# EAGLE design NoMD (EAGLE 9.6.2)
CNAME: Battle Bots Board; CREVISION: R1; DESIGNER: Alexander Blackman

## Sheet 1 of 2
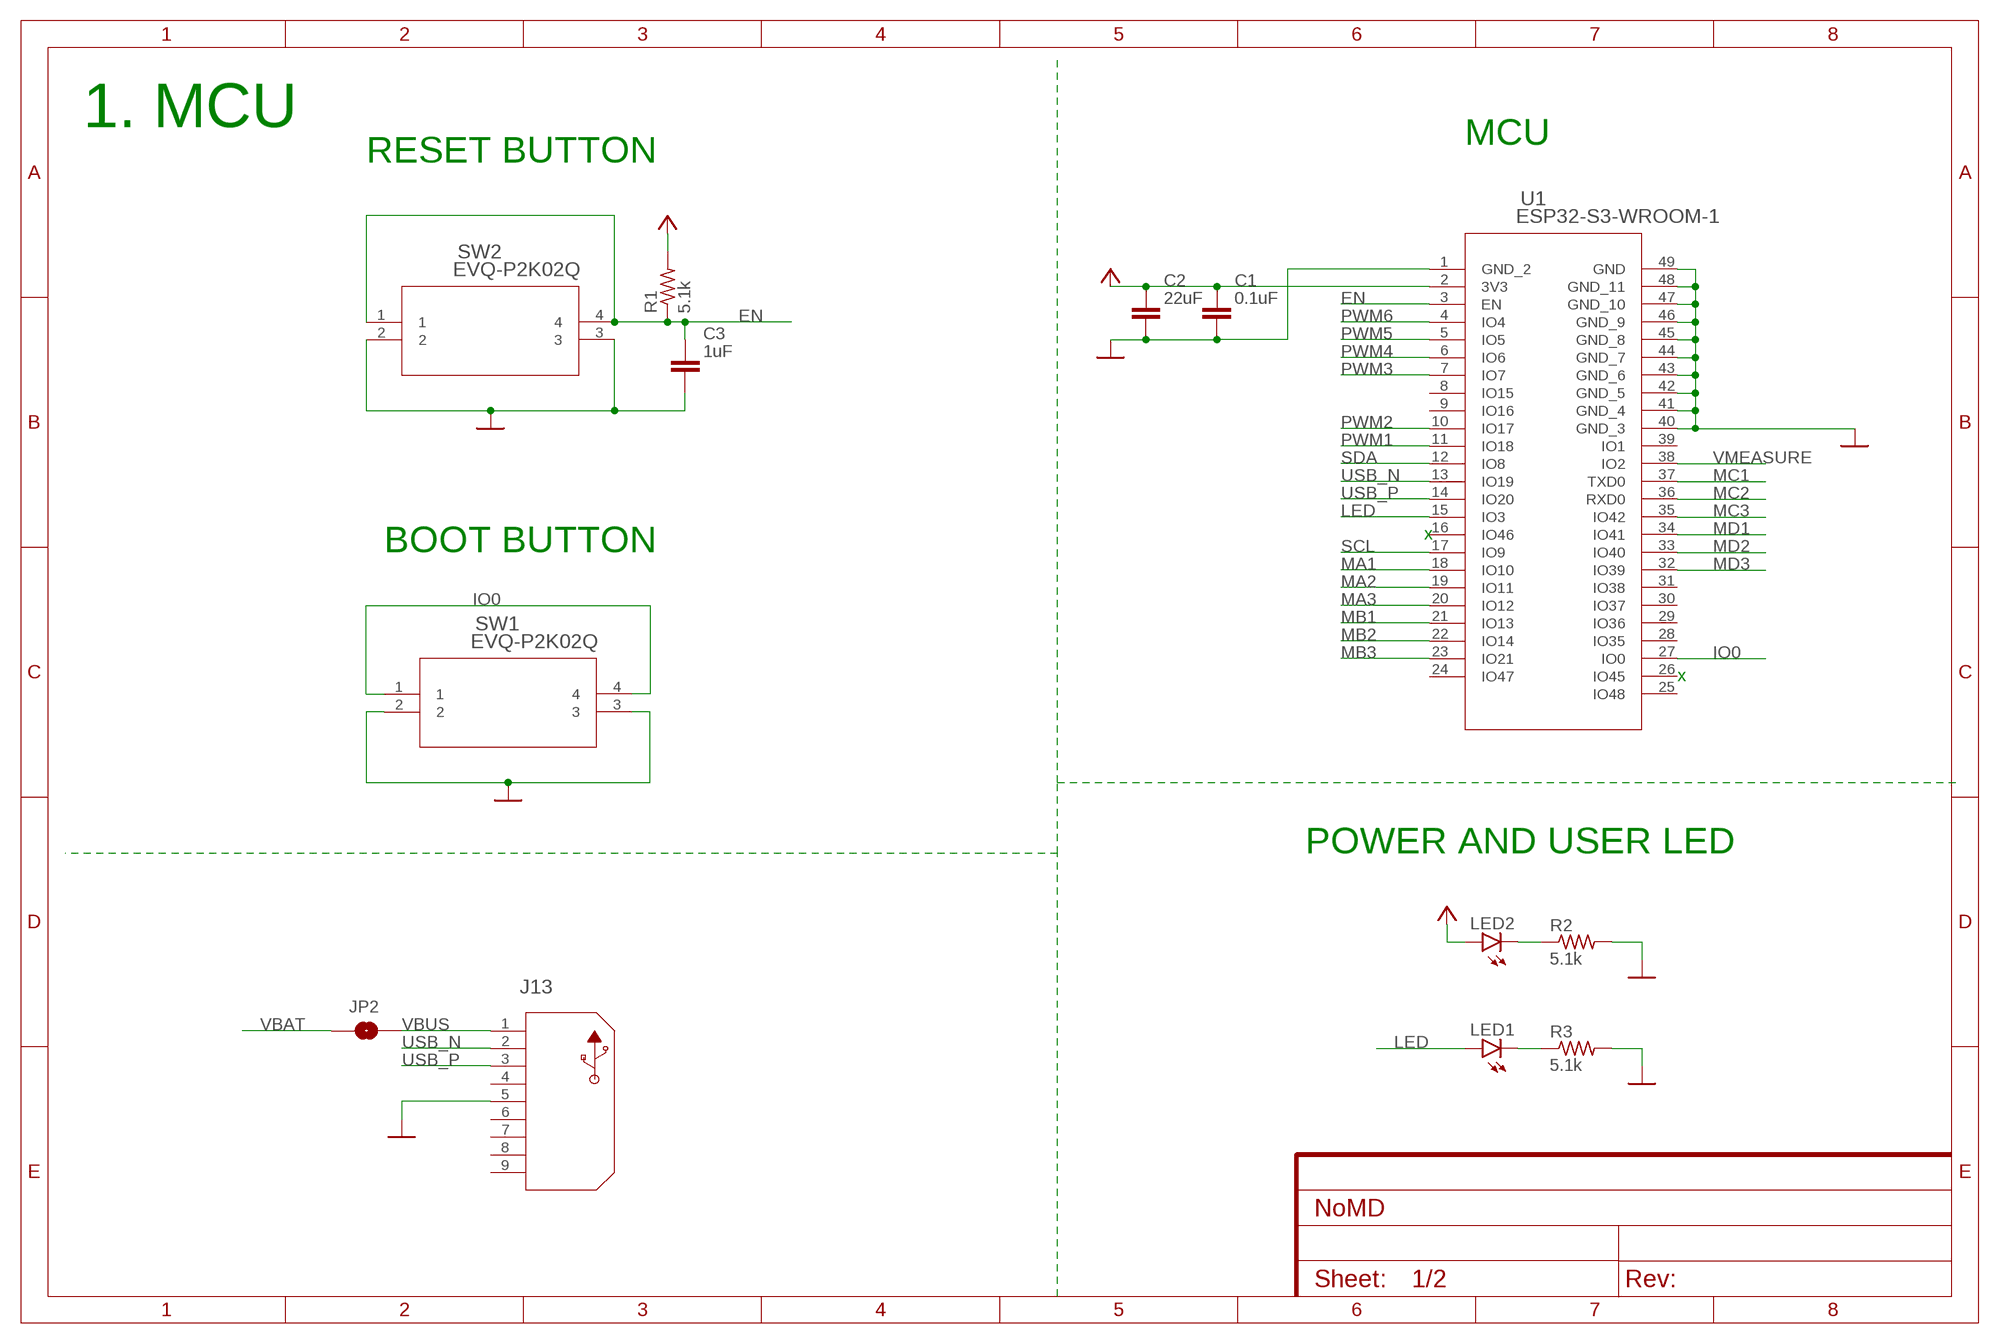
[diagram p0: schematic, sheet 1]

### Parts
C1  0.1uF  C_CHIP-0402(1005-METRIC)  [CAPC1005X60]
C2  22uF  C_CHIP-0402(1005-METRIC)  [CAPC1005X60]
C3  1uF  C_CHIP-0402(1005-METRIC)  [CAPC1005X60]
J13  1734035-2  [CONN5_USB1734035_TEC]
JP2  JUMPER-SMT_2_NO_SILK  [SMT-JUMPER_2_NO_SILK]
LED1  LEDCHIPLED_0603  [CHIPLED_0603]
LED2  LEDCHIPLED_0603  [CHIPLED_0603]
R1  5.1k  R-US_R0402  [R0402]
R2  5.1k  R-US_R0402  [R0402]
R3  5.1k  R-US_R0402  [R0402]
SW1  EVQ-P2K02Q  [EVQP2K_PAN]
SW2  EVQ-P2K02Q  [EVQP2K_PAN]
U1  ESP32-S3-WROOM-1  ESP32-S3-WROOM-1-N16R2  [ESP32-S3-WROOM-1_EXP]

### Nets
+3V3: C1.1 C2.1 LED2.A R1.2 U1.2(3V3) ; also sheet 2
EN: C3.1 R1.1 SW2.1 SW2.4 U1.3(EN)
GND: C1.2 C2.2 C3.2 J13.5 R2.2 R3.2 SW1.2 SW1.3 SW2.2 SW2.3 U1.1(GND_2) U1.40(GND_3) U1.41(GND_4) U1.42(GND_5) U1.43(GND_6) U1.44(GND_7) U1.45(GND_8) U1.46(GND_9) U1.47(GND_10) U1.48(GND_11) U1.49(GND) ; also sheet 2
IO0: SW1.1 SW1.4 U1.27(IO0)
LED: LED1.A U1.15(IO3)
MA1: U1.18(IO10) ; also sheet 2
MA2: U1.19(IO11) ; also sheet 2
MA3: U1.20(IO12) ; also sheet 2
MB1: U1.21(IO13) ; also sheet 2
MB2: U1.22(IO14) ; also sheet 2
MB3: U1.23(IO21) ; also sheet 2
MC1: U1.37(TXD0) ; also sheet 2
MC2: U1.36(RXD0) ; also sheet 2
MC3: U1.35(IO42) ; also sheet 2
MD1: U1.34(IO41) ; also sheet 2
MD2: U1.33(IO40) ; also sheet 2
MD3: U1.32(IO39) ; also sheet 2
N$1: LED2.C R2.1
N$5: LED1.C R3.1
PWM1: U1.11(IO18) ; also sheet 2
PWM2: U1.10(IO17) ; also sheet 2
PWM3: U1.7(IO7) ; also sheet 2
PWM4: U1.6(IO6) ; also sheet 2
PWM5: U1.5(IO5) ; also sheet 2
PWM6: U1.4(IO4) ; also sheet 2
SCL: U1.17(IO9) ; also sheet 2
SDA: U1.12(IO8) ; also sheet 2
USB_N: J13.2 U1.13(IO19)
USB_P: J13.3 U1.14(IO20)
VBAT: JP2.1 ; also sheet 2
VBUS: J13.1 JP2.2
VMEASURE: U1.38(IO2) ; also sheet 2
Unconnected: J13.4 J13.6 J13.7 J13.8 J13.9 U1.8(IO15) U1.9(IO16) U1.16(IO46) U1.24(IO47) U1.25(IO48) U1.26(IO45) U1.28(IO35) U1.29(IO36) U1.30(IO37) U1.31(IO38) U1.39(IO1)

### Notes on the sheet
- 1. MCU
- MCU
- RESET BUTTON
- x
- BOOT BUTTON
- x
- POWER AND USER LED

## Sheet 2 of 2
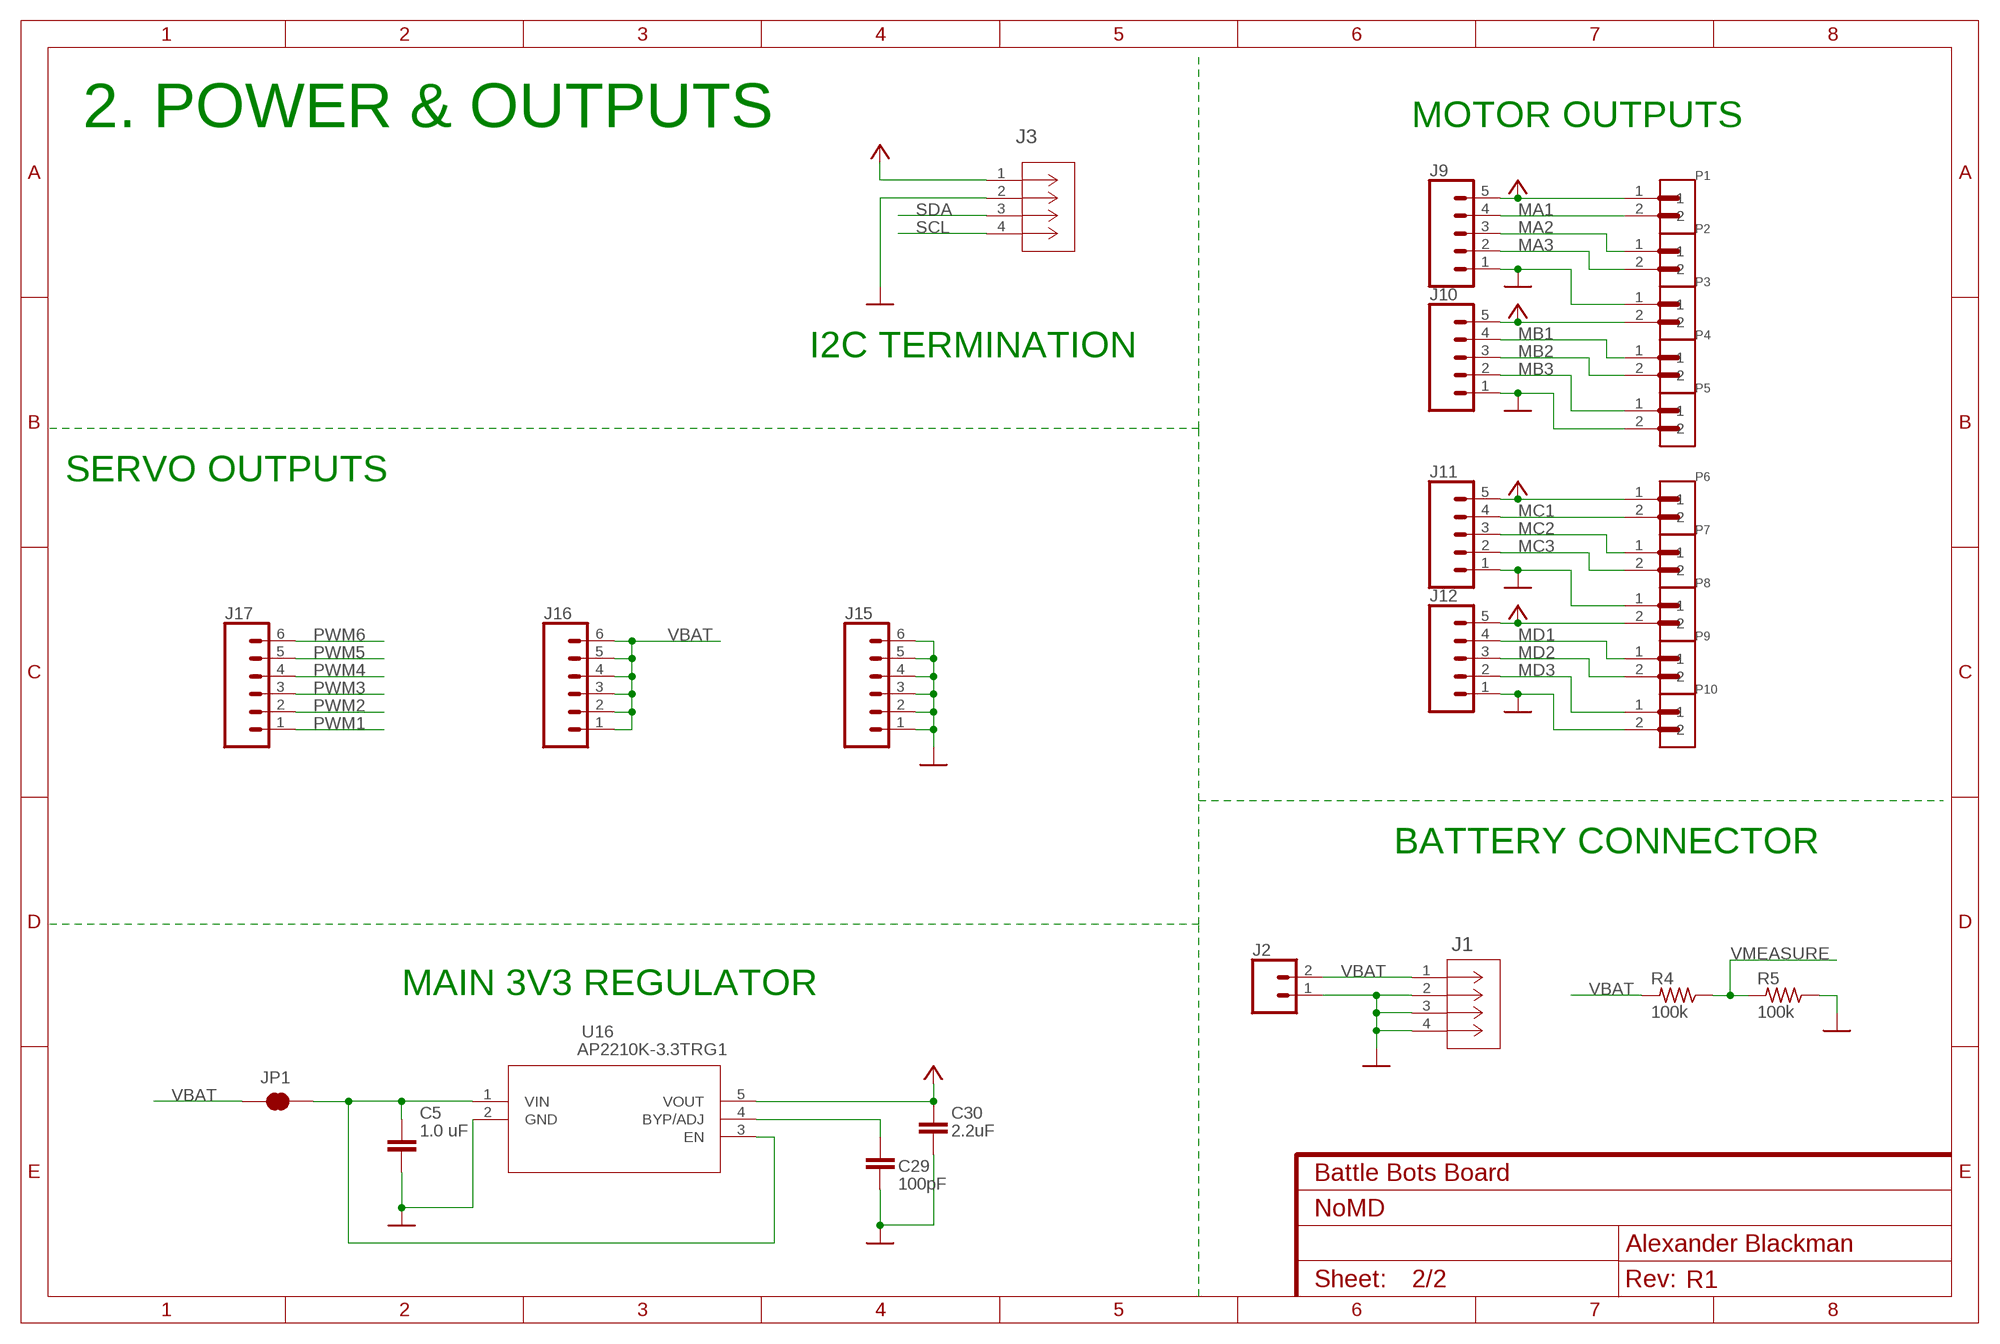
[diagram p1: schematic, sheet 2]

### Parts
C5  1.0 uF  C_CHIP-0402(1005-METRIC)  [CAPC1005X60]
C29  100pF  C_CHIP-0402(1005-METRIC)  [CAPC1005X60]
C30  2.2uF  C_CHIP-0402(1005-METRIC)  [CAPC1005X60]
J1  S2B-PH-SM4-TB(LF)(SN)  [CONN_S2B-PH-SM4-TB_JST]
J2  CONN_021X02_NO_SILK  [1X02_NO_SILK]
J3  SM04B-SRSS-TB(LF)(SN)  [CONN_SM04B_JST]
J9  CONN_05NO_SILK  [1X05_NO_SILK]
J10  CONN_05NO_SILK  [1X05_NO_SILK]
J11  CONN_05NO_SILK  [1X05_NO_SILK]
J12  CONN_05NO_SILK  [1X05_NO_SILK]
J15  CONN_06NO_SILK_NO_POP  [1X06_NO_SILK]
J16  CONN_06NO_SILK_NO_POP  [1X06_NO_SILK]
J17  CONN_06NO_SILK_NO_POP  [1X06_NO_SILK]
JP1  JUMPER-SMT_2_NC_TRACE_NO-SILK  [SMT-JUMPER_2_NC_TRACE_NO-SILK]
P1  OSTTE020104  [OST_OSTTE020104]
P2  OSTTE020104  [OST_OSTTE020104]
P3  OSTTE020104  [OST_OSTTE020104]
P4  OSTTE020104  [OST_OSTTE020104]
P5  OSTTE020104  [OST_OSTTE020104]
P6  OSTTE020104  [OST_OSTTE020104]
P7  OSTTE020104  [OST_OSTTE020104]
P8  OSTTE020104  [OST_OSTTE020104]
P9  OSTTE020104  [OST_OSTTE020104]
P10  OSTTE020104  [OST_OSTTE020104]
R4  100k  R-US_R0402  [R0402]
R5  100k  R-US_R0402  [R0402]
U16  AP2210K-3.3TRG1  [SOT-23-5_DIO]

### Nets
+3V3: C30.1 J3.1 J9.5 J10.5 J11.5 J12.5 P1.1 P3.2 P6.1 P8.2 U16.5(VOUT) ; also sheet 1
GND: C5.2 C29.2 C30.2 J1.2 J1.3(SHIELD_2) J1.4(SHIELD) J2.1 J3.2 J9.1 J10.1 J11.1 J12.1 J15.1 J15.2 J15.3 J15.4 J15.5 J15.6 P3.1 P5.2 P8.1 P10.2 R5.1 U16.2(GND) ; also sheet 1
MA1: J9.4 P1.2 ; also sheet 1
MA2: J9.3 P2.1 ; also sheet 1
MA3: J9.2 P2.2 ; also sheet 1
MB1: J10.4 P4.1 ; also sheet 1
MB2: J10.3 P4.2 ; also sheet 1
MB3: J10.2 P5.1 ; also sheet 1
MC1: J11.4 P6.2 ; also sheet 1
MC2: J11.3 P7.1 ; also sheet 1
MC3: J11.2 P7.2 ; also sheet 1
MD1: J12.4 P9.1 ; also sheet 1
MD2: J12.3 P9.2 ; also sheet 1
MD3: J12.2 P10.1 ; also sheet 1
N$13: C29.1 U16.4(BYP/ADJ)
PWM1: J17.1 ; also sheet 1
PWM2: J17.2 ; also sheet 1
PWM3: J17.3 ; also sheet 1
PWM4: J17.4 ; also sheet 1
PWM5: J17.5 ; also sheet 1
PWM6: J17.6 ; also sheet 1
SCL: J3.4 ; also sheet 1
SDA: J3.3 ; also sheet 1
VBAT: C5.1 J1.1 J2.2 J16.1 J16.2 J16.3 J16.4 J16.5 J16.6 JP1.1 JP1.2 R4.2 U16.1(VIN) U16.3(EN) ; also sheet 1
VMEASURE: R4.1 R5.2 ; also sheet 1

### Notes on the sheet
- 2. POWER & OUTPUTS | MOTOR OUTPUTS
- I2C TERMINATION
- SERVO OUTPUTS
- BATTERY CONNECTOR
- MAIN 3V3 REGULATOR

## Library data of the parts
C1-C3 C5 C29 C30 = Capacitor:C: Capacitor - Generic; CATEGORY: Capacitor
J1 = PH-RightAngle-Supports:S2B-PH-SM4-TB(LF)(SN); COPYRIGHT: Copyright (C) 2022 Ultra Librarian. All rights reserved.; DIGI-KEY_PART_NUMBER_1: 455-1749-2-ND; DIGI-KEY_PART_NUMBER_2: 455-1749-1-ND; DIGI-KEY_PART_NUMBER_3: 455-1749-6-ND; MANUFACTURER_PART_NUMBER: S2B-PH-SM4-TB(LF)(SN); MFR_NAME: JST
J2 = SparkFun-Connectors:CONN_02: Multi connection point. Often used as Generic Header-pin footprint for 0.1 inch spaced/style header connections On any of the 0.1 inch spaced packages, you can populate with these: Break Away Headers - Straight <https://www.sparkfun.com/products/116> (PRT-00116) Break Away Male Headers - Right Angle <https://www.sparkfun.com/products/553> (PRT-00553) Female Headers <https://www.sparkfun.com/products/115> (PRT-00115) Break Away Headers - Machine Pin <https://www.sparkfun.com/products/117> (PRT-00117) Break Away Female Headers - Swiss Machine Pin <https://www.sparkfun.com/products/743> (PRT-00743) For SCREWTERMINALS and SPRING TERMINALS visit here: Screw Terimnals on SparkFun.com <https://www.sparkfun.com/search/results?term=Screw+Terminals> (5mm/3.5mm/2.54mm spacing) This device is also useful as a general connection point to wire up your design to another part of your project. Our various solder wires solder well into these plated through hole pads. Hook-Up Wire - Assortment (Stranded, 22 AWG) <https://www.sparkfun.com/products/11375> (PRT-11375) Hook-Up Wire - Assortment (Solid Core, 22 AWG) <https://www.sparkfun.com/products/11367> (PRT-11367) View the entire wire category on our website here <https://www.sparkfun.com/categories/141> Special notes: Molex polarized connector foot print use with: PRT-08233 with associated crimp pins and housings. 2.54_SCREWTERM for use with PRT-10571. 3.5mm Screw Terminal footprints for PRT-08084 5mm Screw Terminal footprints for use with PRT-08432
J3 = SH_4_POS_RA:SM04B-SRSS-TB(LF)(SN); COPYRIGHT: Copyright (C) 2023 Ultra Librarian. All rights reserved.; DIGIKEY_PART_NUMBER_1: 455-1804-2-ND; DIGIKEY_PART_NUMBER_2: 455-1804-1-ND; DIGIKEY_PART_NUMBER_3: 455-1804-6-ND; MANUFACTURER_PART_NUMBER: SM04B-SRSS-TB(LF)(SN); MFR_NAME: JST
J9-J12 = SparkFun-Connectors:CONN_05: Multi connection point. Often used as Generic Header-pin footprint for 0.1 inch spaced/style header connections On any of the 0.1 inch spaced packages, you can populate with these: Break Away Headers - Straight <https://www.sparkfun.com/products/116> (PRT-00116) Break Away Male Headers - Right Angle <https://www.sparkfun.com/products/553> (PRT-00553) Female Headers <https://www.sparkfun.com/products/115> (PRT-00115) Break Away Headers - Machine Pin <https://www.sparkfun.com/products/117> (PRT-00117) Break Away Female Headers - Swiss Machine Pin <https://www.sparkfun.com/products/743> (PRT-00743) For SCREWTERMINALS and SPRING TERMINALS visit here: Screw Terimnals on SparkFun.com <https://www.sparkfun.com/search/results?term=Screw+Terminals> (5mm/3.5mm/2.54mm spacing) This device is also useful as a general connection point to wire up your design to another part of your project. Our various solder wires solder well into these plated through hole pads. Hook-Up Wire - Assortment (Stranded, 22 AWG) <https://www.sparkfun.com/products/11375> (PRT-11375) Hook-Up Wire - Assortment (Solid Core, 22 AWG) <https://www.sparkfun.com/products/11367> (PRT-11367) View the entire wire category on our website here <https://www.sparkfun.com/categories/141> Special notes: Molex polarized connector foot print use with SKU : PRT-08231 with associated crimp pins and housings. 1MM SMD Version SKU: PRT-10208
J13 = MINI-USB:1734035-2; COPYRIGHT: Copyright (C) 2022 Ultra Librarian. All rights reserved.; MANUFACTURER_PART_NUMBER: 1734035-2; MFR_NAME: TE Connectivity; TYPE: USB 2.0
J15-J17 = SparkFun-Connectors:CONN_06: Multi connection point. Often used as Generic Header-pin footprint for 0.1 inch spaced/style header connections On any of the 0.1 inch spaced packages, you can populate with these: Break Away Headers - Straight <https://www.sparkfun.com/products/116> (PRT-00116) Break Away Male Headers - Right Angle <https://www.sparkfun.com/products/553> (PRT-00553) Female Headers <https://www.sparkfun.com/products/115> (PRT-00115) Break Away Headers - Machine Pin <https://www.sparkfun.com/products/117> (PRT-00117) Break Away Female Headers - Swiss Machine Pin <https://www.sparkfun.com/products/743> (PRT-00743) Arduino Stackable Header - 6 Pin <https://www.sparkfun.com/products/9280> (PRT-09280) For SCREWTERMINALS and SPRING TERMINALS visit here: Screw Terimnals on SparkFun.com <https://www.sparkfun.com/search/results?term=Screw+Terminals> (5mm/3.5mm/2.54mm spacing) This device is also useful as a general connection point to wire up your design to another part of your project. Our various solder wires solder well into these plated through hole pads. Hook-Up Wire - Assortment (Stranded, 22 AWG) <https://www.sparkfun.com/products/11375> (PRT-11375) Hook-Up Wire - Assortment (Solid Core, 22 AWG) <https://www.sparkfun.com/products/11367> (PRT-11367) View the entire wire category on our website here <https://www.sparkfun.com/categories/141>
JP1 = SparkFun-Jumpers:JUMPER-SMT_2_NC_TRACE: Normally closed trace jumper This jumper has a trace between two pads so it's normally closed (NC). Use a razor knife to open the connection. For best results follow the IPC guidelines for cutting traces: Cutout at least 0.063 mm (0.005 in). Remove all loose material to clean up the cut area. Seal the cut with an approved epoxy. Reapply solder to reclose the connection.
JP2 = SparkFun-Jumpers:JUMPER-SMT_2_NO: Normally open jumper This jumper has two pads in close proximity to each other. Apply solder to close the connection. Round pads are easier to solder for beginners, but are a lot larger. SparkFun Product that uses the round pads: SparkFun EL Sequencer <https://www.sparkfun.com/products/12781>
LED1 LED2 = led:LED: LED OSRAM: - CHIPLED LG R971, LG N971, LY N971, LG Q971, LY Q971, LO R971, LY R971 LH N974, LH R974 LS Q976, LO Q976, LY Q976 LO Q996 - Hyper CHIPLED LW Q18S LB Q993, LB Q99A, LB R99A - SideLED LS A670, LO A670, LY A670, LG A670, LP A670 LB A673, LV A673, LT A673, LW A673 LH A674 LY A675 LS A676, LA A676, LO A676, LY A676, LW A676 LS A679, LY A679, LG A679 - Hyper Micro SIDELED® LS Y876, LA Y876, LO Y876, LY Y876 LT Y87S - SmartLED LW L88C, LW L88S LB L89C, LB L89S, LG L890 LS L89K, LO L89K, LY L89K LS L896, LA L896, LO L896, LY L896 - TOPLED LS T670, LO T670, LY T670, LG T670, LP T670 LSG T670, LSP T670, LSY T670, LOP T670, LYG T670 LG T671, LOG T671, LSG T671 LB T673, LV T673, LT T673, LW T673 LH T674 LS T676, LA T676, LO T676, LY T676, LB T676, LH T676, LSB T676, LW T676 LB T67C, LV T67C, LT T67C, LS T67K, LO T67K, LY T67K, LW E67C LS E67B, LA E67B, LO E67B, LY E67B, LB E67C, LV E67C, LT E67C LW T67C LS T679, LY T679, LG T679 LS T770, LO T770, LY T770, LG T770, LP T770 LB T773, LV T773, LT T773, LW T773 LH T774 LS E675, LA E675, LY E675, LS T675 LS T776, LA T776, LO T776, LY T776, LB T776 LHGB T686 LT T68C, LB T68C - Hyper Mini TOPLED® LB M676 - Mini TOPLED Santana® LG M470 LS M47K, LO M47K, LY M47K Source: http://www.osram.convergy.de LUXEON: - LUMILED® LXK2-PW12-R00, LXK2-PW12-S00, LXK2-PW14-U00, LXK2-PW14-V00 LXK2-PM12-R00, LXK2-PM12-S00, LXK2-PM14-U00 LXK2-PE12-Q00, LXK2-PE12-R00, LXK2-PE12-S00, LXK2-PE14-T00, LXK2-PE14-U00 LXK2-PB12-K00, LXK2-PB12-L00, LXK2-PB12-M00, LXK2-PB14-N00, LXK2-PB14-P00, LXK2-PB14-Q00 LXK2-PR12-L00, LXK2-PR12-M00, LXK2-PR14-Q00, LXK2-PR14-R00 LXK2-PD12-Q00, LXK2-PD12-R00, LXK2-PD12-S00 LXK2-PH12-R00, LXK2-PH12-S00 LXK2-PL12-P00, LXK2-PL12-Q00, LXK2-PL12-R00 Source: www.luxeon.com KINGBRIGHT: KA-3528ASYC Source: www.kingbright.com
P1-P10 = Terminal:OSTTE020104: Terminal Block 3.5mm 2pos Pcb; DESCRIPTION: 2 Position Wire to Board Terminal Block Horizontal with Board 0.138 (3.50mm) Through Hole; DIGI-KEY_PART_NUMBER: ED2740-ND; MF: On Shore; MP: OSTTE020104; PACKAGE: None; PURCHASE-URL: https://pricing.snapeda.com/search/part/OSTTE020104/?ref=eda
R1-R5 = rcl:R-US_: RESISTOR, American symbol; SPICEPREFIX: R
SW1 SW2 = Button:EVQ-P2K02Q; COPYRIGHT: Copyright (C) 2022 Ultra Librarian. All rights reserved.; MANUFACTURER_PART_NUMBER: EVQ-P2K02Q; MFR_NAME: Panasonic
U1 = ESP32-S3-WROOM-1:ESP32-S3-WROOM-1-N16R2; COPYRIGHT: Copyright (C) 2023 Ultra Librarian. All rights reserved.; DIGI-KEY_PART_NUMBER_1: 1965-ESP32-S3-WROOM-1-N16R2TR-ND; DIGI-KEY_PART_NUMBER_2: 1965-ESP32-S3-WROOM-1-N16R2CT-ND; DIGI-KEY_PART_NUMBER_3: 1965-ESP32-S3-WROOM-1-N16R2DKR-ND; MANUFACTURER_PART_NUMBER: ESP32-S3-WROOM-1-N16R2; MFR_NAME: Espressif Systems
U16 = AP2210K-3.3:AP2210K-3.3TRG1; COPYRIGHT: Copyright (C) 2023 Ultra Librarian. All rights reserved.; DIGI-KEY_PART_NUMBER_1: AP2210K-3.3TRG1DITR-ND; DIGI-KEY_PART_NUMBER_2: AP2210K-3.3TRG1DICT-ND; DIGI-KEY_PART_NUMBER_3: AP2210K-3.3TRG1DIDKR-ND; MANUFACTURER_PART_NUMBER: AP2210K-3.3TRG1; MFR_NAME: Diodes Inc

## Board
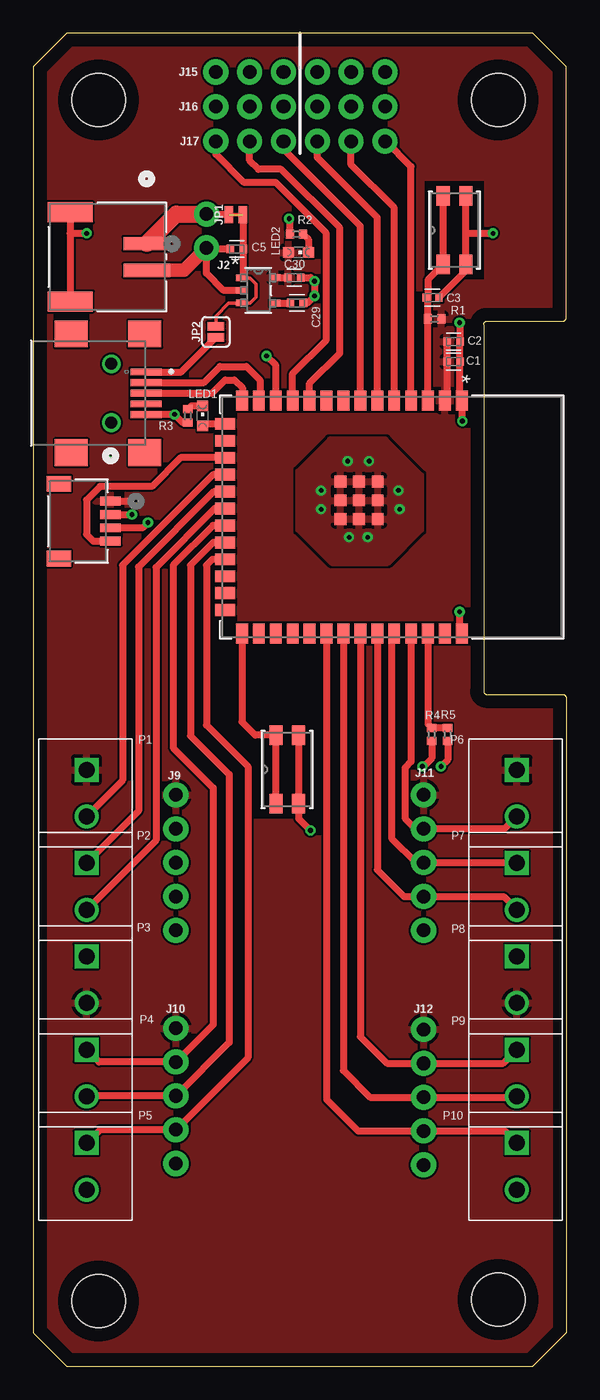
[diagram p2: board, top side]
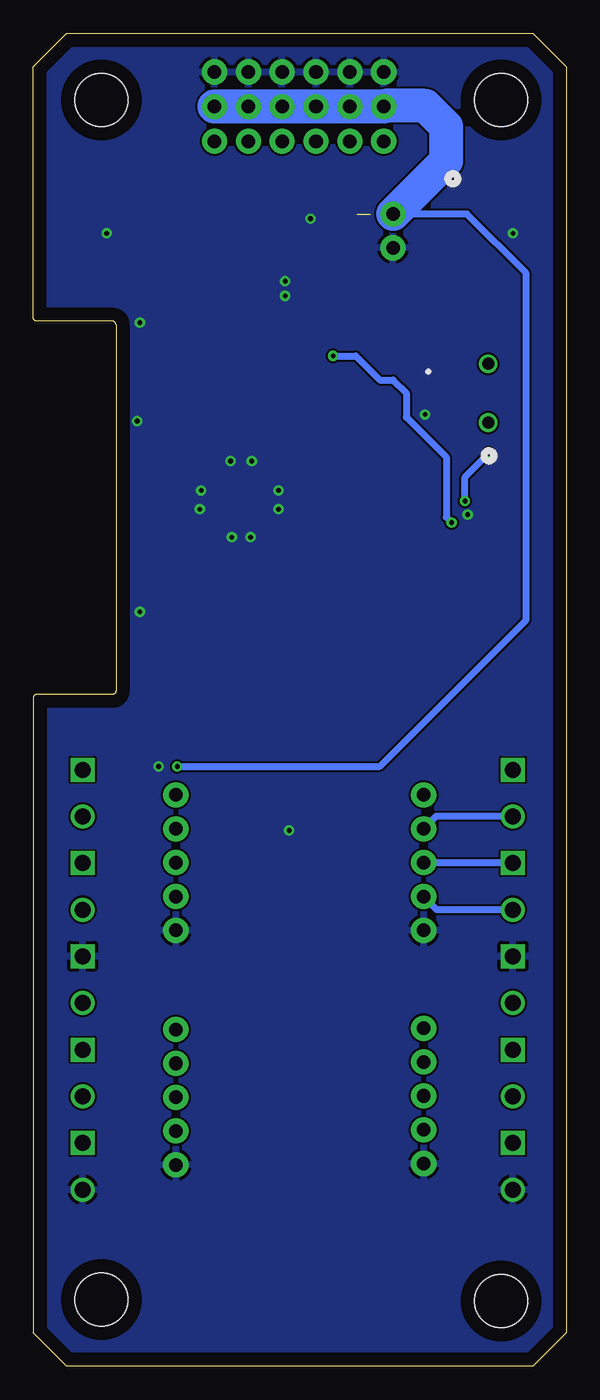
[diagram p3: board, bottom side, seen from below]

Size 40 x 100 mm. Coordinates in mm from the lower left corner, seen from the top.
Outline: 37.5,100 2.5,100 0,97.5 0,2.5 2.5,0 37.5,0 40,2.5 40,50.15 arc90 39.75,50.4 34.05,50.4 arc-90 33.8,50.65 33.8,78.15 arc-90 34.05,78.4 39.75,78.4 arc90 40,78.65 40,97.5 37.5,100
Copper layers (1*16): Top 0.035mm / dielectric 1.5mm / Bottom 0.035mm
Design rules "default *": minimum track width 6mil, minimum drill 0.35mm, track to track 6mil, track to pad 6mil, pad to pad 6mil, via to via 6mil, smd to smd 6mil, copper to edge 40mil, drill to drill 6mil, minimum pad ring 10mil, minimum via ring 8mil, stop-mask expansion 4mil, vias tented up to drill 20mil, thermal gap 10mil
Holes 4 mm at 4.9,4.9 34.9,5 34.9,95 4.9,95

### Footprints (pad centres in the part's own frame; a part is rotated, then mirrored left to right if it is on the bottom)
CAPC1005X60 = smd 0.56 x 0.629: 1 -0.485,0; 2 0.485,0
CONN_S2B-PH-SM4-TB_JST = smd 0.991 x 3.505: 1 -1,2.955; 2 1,2.955 | smd 1.499 x 3.404: 3 -3.35,-2.795; 4 3.35,-2.795
1X02_NO_SILK = drill 1.016 pad 1.88: 1 0,0; 2 2.54,0
CONN_SM04B_JST = smd 0.66 x 1.549: 1 0,0; 2 1,0; 3 2,0; 4 3,0 | smd 1.194 x 1.803: 5 -1.3,-3.875; 6 4.3,-3.875
1X05_NO_SILK = drill 1.016 pad 1.88: 1 0,0; 2 2.54,0; 3 5.08,0; 4 7.62,0; 5 10.16,0
CONN5_USB1734035_TEC = smd 0.508 x 2.311: 1 -1.6,4.461; 2 -0.8,4.461; 3 0,4.461; 4 0.8,4.461; 5 1.6,4.461 | smd 2.007 x 2.489: 6 -4.45,4.366; 7 4.45,4.366; 8 -4.45,-1.145; 9 4.45,-1.145 | drill 0.889 pad 0.889: 10 -2.21,1.854; 11 2.21,1.854
1X06_NO_SILK = drill 1.016 pad 1.88: 1 0,0; 2 2.54,0; 3 5.08,0; 4 7.62,0; 5 10.16,0; 6 12.7,0
SMT-JUMPER_2_NC_TRACE_NO-SILK = smd 0.635 x 1.27: 1 -0.508,0; 2 0.508,0
SMT-JUMPER_2_NO_SILK = smd 0.635 x 1.27: 1 -0.406,0; 2 0.406,0
CHIPLED_0603 = smd 0.8 x 0.8: A 0,-0.75; C 0,0.75
OST_OSTTE020104 = drill 1.2 square: 1 -1.75,0 | drill 1.2: 2 1.75,0
R0402 = smd 0.6 x 0.7: 1 -0.5,0; 2 0.5,0
EVQP2K_PAN = smd 1.448 x 0.991: 1 -2.575,0.85; 2 -2.575,-0.85; 3 2.575,-0.85; 4 2.575,0.85
ESP32-S3-WROOM-1_EXP = smd 1.499 x 0.889: 1 -8.75,5.26; 2 -8.75,3.99; 3 -8.75,2.72; 4 -8.75,1.45; 5 -8.75,0.18; 6 -8.75,-1.09; 7 -8.75,-2.36; 8 -8.75,-3.63; 9 -8.75,-4.9; 10 -8.75,-6.17; 11 -8.75,-7.44; 12 -8.75,-8.71; 13 -8.75,-9.98; 14 -8.75,-11.25; 27 8.75,-11.25; 28 8.75,-9.98; 29 8.75,-8.71; 30 8.75,-7.44; 31 8.75,-6.17; 32 8.75,-4.9; 33 8.75,-3.63; 34 8.75,-2.36; 35 8.75,-1.09; 36 8.75,0.18; 37 8.75,1.45; 38 8.75,2.72; 39 8.75,3.99; 40 8.75,5.26 | smd 0.889 x 1.499: 15 -6.985,-12.5; 16 -5.715,-12.5; 17 -4.445,-12.5; 18 -3.175,-12.5; 19 -1.905,-12.5; 20 -0.635,-12.5; 21 0.635,-12.5; 22 1.905,-12.5; 23 3.175,-12.5; 24 4.445,-12.5; 25 5.715,-12.5; 26 6.985,-12.5 | smd 0.889 x 0.889: 41 -1.25,-2.46; 42 -1.25,-1.06; 43 -2.65,-1.06; 44 -2.65,-2.46; 45 -2.65,-3.86; 46 -1.25,-3.86; 47 0.15,-3.86; 48 0.15,-2.46; 49 0.15,-1.06
SOT-23-5_DIO = smd 0.826 x 0.508: 1 -1.264,0.94; 2 -1.264,0; 3 -1.264,-0.94; 4 1.264,-0.953; 5 1.264,0.953

### Placement (x,y rotation side)
C1  31.54,75.37 0 top
C2  31.54,76.87 0 top
C3  29.96,80.17 0 top
C5  15.27,83.82 180 top
C29  19.79,79.77 0 top
C30  19.59,81.67 0 top
J1  5.56,83.22 270 top
J2  13,83.9 90 top
J3  5.8,64.9 270 top
J9  10.7,32.7 90 top
J10  10.7,15.2 90 top
J11  29.3,32.7 90 top
J12  29.3,15.1 90 top
J13  4,73 270 top
J15  13.7,97.1 0 top
J16  13.7,94.5 0 top
J17  13.7,91.9 0 top
JP1  15.2,86.4 180 top
JP2  13.7,77.6 270 top
LED1  12.7,71.3 0 top
LED2  19.9,83.56 270 top
P1  4,43 270 top
P2  4,36 270 top
P3  4,29 270 top
P4  4,22 270 top
P5  4,15 270 top
P6  36.3,43 270 top
P7  36.3,36 270 top
P8  36.3,29 270 top
P9  36.3,22 270 top
P10  36.3,15 270 top
R1  30.12,78.57 0 top
R2  19.76,84.93 180 top
R3  11.6,71.3 270 top
R4  29.9,47.4 270 top
R5  31.1,47.4 90 top
SW1  19.06,44.77 90 top
SW2  31.61,85.23 90 top
U1  26.91,63.71 270 top
U16  16.89,80.71 0 top

### Tracks (layer width: path | path; a pad name or v marks a point on that pad's centre or on a via)
+3V3  (via drill 0.35)
  Top 0.508: U1.2 31.05,72.61 C1.1 C2.1 | U16.5 18.16,81.67 C30.1 | J3.1 v7.6,64.9
  Bottom 0.508: v7.6,64.9 7.6,66.7 v5.8,68.5
  pour Top (rank 2): -5,101 -5,-4 45,-4 45,101
EN
  Top 0.508: U1.3 R1.1 29.62,80.03 | 29.62,80.03 C3.1 | 29.62,80.03 29.62,81.52 SW2.1 SW2.4
GND  (via drill 0.35)
  Top 0.508: SW1.3 SW1.2 19.91,41.09 v20.8,40.2 | v32,78.3 32.02,78.28 C2.2 C1.2 32.02,72.61 U1.1 32.17,70.93 v32.2,70.9 | J1.3 2.77,85 | 2.77,85 J1.4 | C3.2 32.46,82.19 SW2.2 32.46,85 | 32.46,85 SW2.3 | 32.46,85 v34.5,85 | U16.2 14.29,80.71 13,82 J2.1 13.08,83.82 C5.2 | R2.2 19.26,86.04 v19.2,86.1 | C30.2 20.83,81.67 v21.1,81.4 v21.1,80.3 20.57,79.77 C29.2 | 2.77,85 v4,85 | R5.1 31.1,45.5 v30.6,45 | J3.2 v7.4,63.9 | R3.2 11.2,70.8 v10.6,71.4 J13.5 | U1.40 32,55.13 v32,56.6
  Top 1.016: J2.1 11.32,82.22 J1.2
  other vias: 23.6,67.9 25.2,67.9 21.6,65.7 21.6,64.3 23.7,62.2 25.1,62.2 27.5,64.3 27.4,65.7
  pour Bottom: 44,104 -7,104 -7,-5 44,-5
  pour Top: 22.3,69.5 19.9,67.1 19.9,62.8 22.4,60.3 26.6,60.3 29.1,62.8 29.1,66.8 26.4,69.5
IO0
  Top 0.508: U1.27 15.66,48.34 16.66,47.34 SW1.4 SW1.1
LED
  Top 0.508: U1.15 12.85,70.69 LED1.A
MA1
  Top 0.508: P1.2 6.7,43.95 6.7,60.1 13.48,66.89 U1.18
  Bottom 0.508: P1.2 9.77,41.25 J9.4
MA2
  Top 0.508: P2.1 7.9,41.65 7.9,59.97 13.55,65.61 U1.19
  Bottom 0.508: P2.1 10.67,37.75 J9.3
MA3
  Top 0.508: P2.2 9.2,39.45 9.2,59.93 13.61,64.34 U1.20
  Bottom 0.508: P2.2 9.71,34.25 J9.2
MB1
  Top 0.508: P4.1 4.93,22.82 J10.4 13.5,25.62 13.5,43.4 10.5,46.4 10.5,60.1 13.47,63.08 U1.21
MB2
  Top 0.508: P4.2 4.03,20.28 J10.3 14.7,24.28 14.7,44.4 11.8,47.3 11.8,60.1 13.51,61.8 U1.22
MB3
  Top 0.508: P5.1 5,17.75 J10.2 16.1,23.14 16.1,45 13,48.1 13,60.1 13.44,60.53 U1.23
MC1
  Top 0.254: 28.68,40.32 29,40.32 J11.4
  Top 0.508: U1.37 28.36,45.36 27.9,44.9 27.9,41.1 28.68,40.32 | P6.2 35.37,40.32 29,40.32
MC2
  Top 0.508: U1.36 26.89,54.76 26.89,39.6 28.71,37.78 J11.3 36.27,37.78 P7.1
MC3
  Top 0.508: U1.35 25.82,37.24 27.82,35.24 J11.2 35.31,35.24 P7.2
MD1
  Top 0.508: U1.34 24.55,24.72 26.55,22.72 J12.4 35.27,22.72 P9.1
MD2
  Top 0.508: U1.33 23.28,22.18 25.28,20.18 J12.3 36.23,20.18 P9.2
MD3
  Top 0.508: U1.32 22.01,20.01 24.38,17.64 J12.2 35.41,17.64 P10.1
N$1
  Top 0.508: R2.1 20.65,84.54 LED2.C
N$5
  Top 0.508: LED1.C 11.85,72.05 R3.1
N$13
  Top 0.508: U16.4 18.17,79.77 C29.1
PWM1
  Top 0.508: U1.11 19.47,74.47 22,77 22,85 18.2,88.8 15.82,88.8 13.7,90.92 J17.1
PWM2
  Top 0.508: U1.10 20.74,73.74 23,76 23,85.4 18.6,89.8 16.9,89.8 16.24,90.46 J17.2
PWM3
  Top 0.508: U1.7 24.55,85.55 18.78,91.32 J17.3
PWM4
  Top 0.508: U1.6 25.82,86.18 21.32,90.68 J17.4
PWM5
  Top 0.508: U1.5 27.09,86.91 23.86,90.14 J17.5
PWM6
  Top 0.254: 26.46,91.9 J17.6
  Top 0.508: U1.4 28.36,90 26.46,91.9
SCL
  Top 0.508: U1.17 11.05,68.16 8.9,66 5,66 4,65 4,62.4 4.5,61.9 J3.4
SDA  (via drill 0.35)
  Top 0.508: U1.12 18.2,75.1 v17.5,75.8 | v8.6,63.3 8.2,62.9 J3.3
  Bottom 0.508: v17.5,75.8 15.8,75.8 14,74 13,74 12,73 12,71.2 9,68.2 9,63.7 v8.6,63.3
USB_N
  Top 0.508: J13.2 12.8,73.8 14,75 16,75 17,74 17,72 16.93,72.07 U1.13
USB_P
  Top 0.508: J13.3 13.4,73 14.4,74 15.1,74 15.7,73.4 15.7,72.5 U1.14
VBAT  (via drill 0.35)  (1 unrouted)
  Top 0.254: U16.1 16.25,81.65 16.7,81.2 16.7,80.2 16.27,79.77 U16.3 14.67,79.77 13.7,78.8 JP2.1
  Top 0.508: J2.2 14.65,86.44 JP1.2 | JP1.1 15.76,86.35 C5.1 15.76,81.78 U16.1 | R4.2 29.9,45.6 29.3,45 v29.2,45
  Top 1.27: J1.1 10.73,86.44 J2.2
  Bottom 0.508: v29.2,45 14,45 3,56 3,82 7.44,86.44 J2.2
  Bottom 2.54: J2.2 9,90.44 9,93 10.56,94.56 13.64,94.56 J16.1 J16.2 J16.3 J16.4 J16.5 J16.6
VBUS
  Top 0.508: JP2.2 11.11,74.6 J13.1
VMEASURE
  Top 0.508: U1.38 29.63,48.17 R4.1 R5.2

### Text on the board
200bmp: GND | VBAT | PWM | 1 | 2 | 3 | 4 | 5 | 6 | VBAT | GND | 3V3 | 3V3 | MA1 | MC1 | MA2 | MC2 | MA3 | MC3 | GND | GND | BATTLE BOTS / EQUAL CONTROL / SYSTEM BOARD | 3V3 | 3V3 | MB1 | MD1 | MB2 | MD2 | MB3 | MD3 | GND | GND | BY AB 2023
201bmp: PWM1 - IO18 / PWM2 - IO17 / PWM3 - IO7 / PWM4 - IO6 / PWM5 - IO5 / PWM6 - IO4 / / MA1 - IO10 / MA2 - IO11 / MA3 - IO12 / MB1 - IO13 / MB2 - IO14 / MB3 - IO21 / MC1 - IO43 / MC2 - IO44 / MC3 - IO42 / MD1 - IO41 / MD2 - IO40 / MD3 - IO39 / / / LED - IO3 / VBAT - IO2